# EAGLE design Digipot (EAGLE 9.3.0)
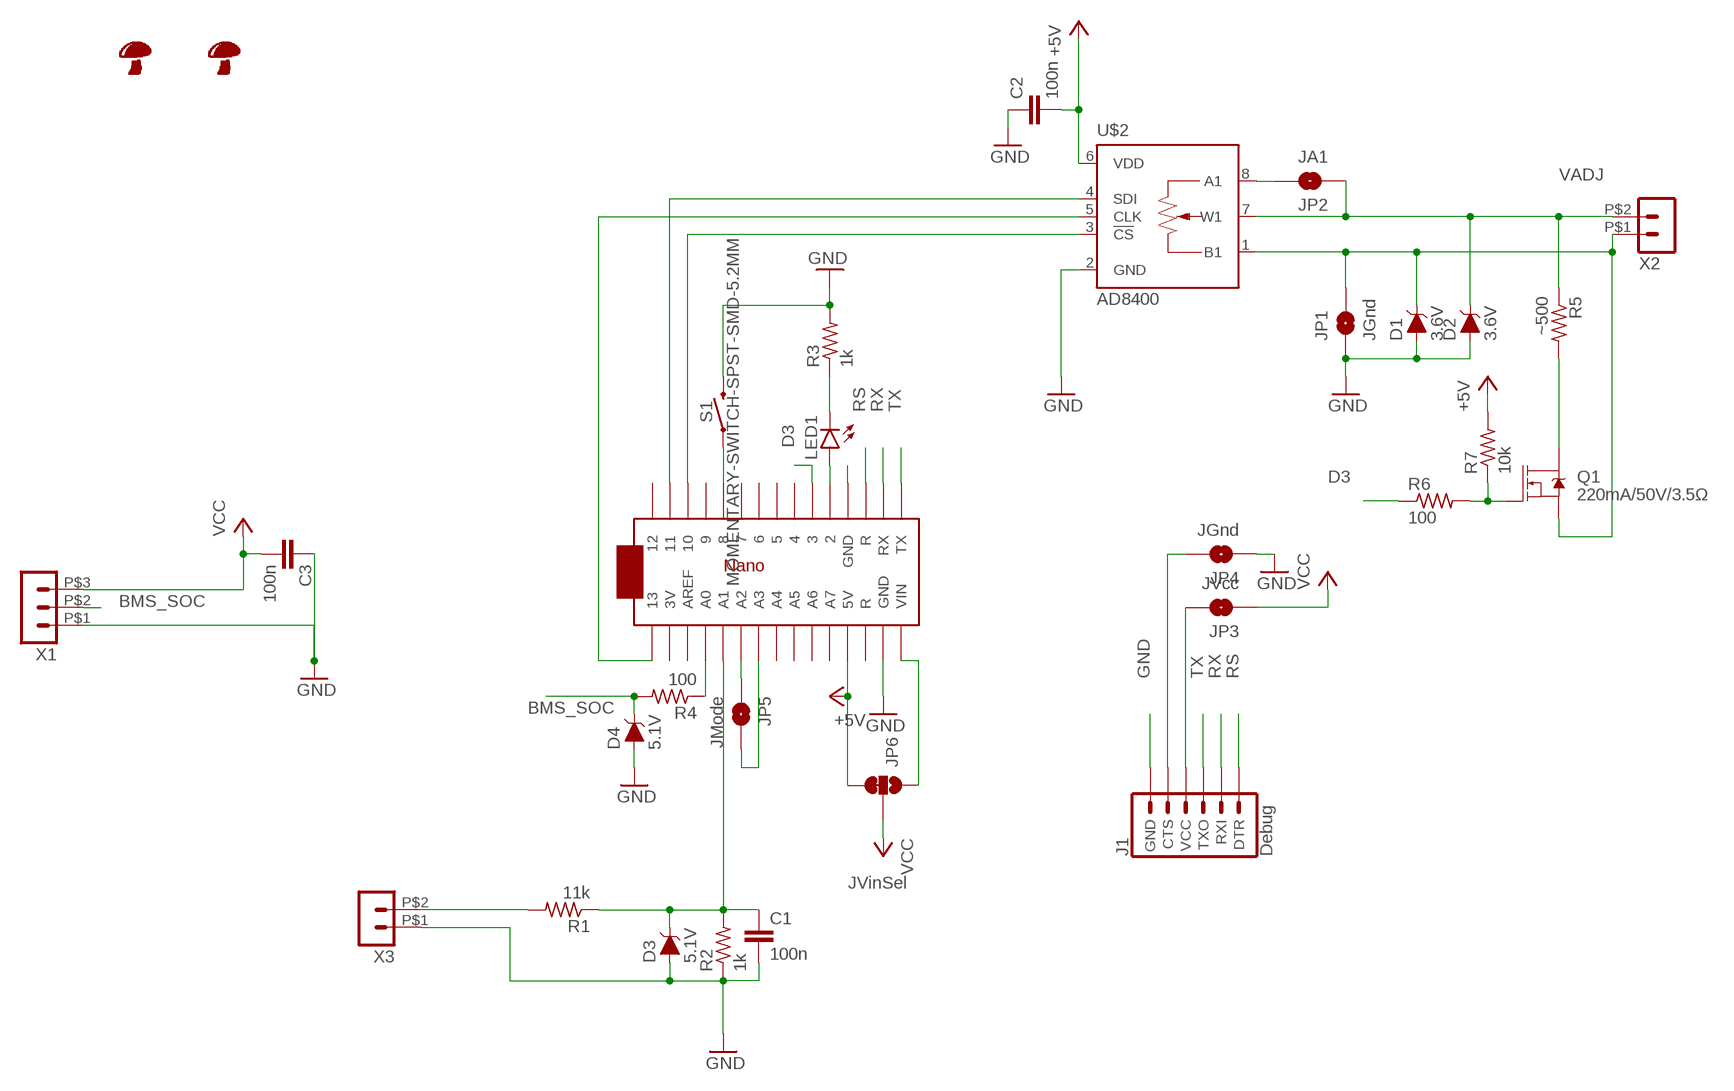
[diagram p0: schematic, sheet 1]

## Parts
C1  100n  C-EUC0805  [C0805]
C2  100n  C-EUC0805  [C0805]
C3  100n  C-EUC0805  [C0805]
D1  3.6V  DIODE-ZENER-BZT52C3V6S  [SOD-323]
D2  3.6V  DIODE-ZENER-BZT52C3V6S  [SOD-323]
D3  5.1V  DIODE-ZENER-BZT52C3V6S  [SOD-323]
D4  5.1V  DIODE-ZENER-BZT52C3V6S  [SOD-323]
J1  Debug  6_PIN_SERIAL_TARGETLOCK  [1X06_LOCK]
JP1  JGnd  JUMPER-SMT_2_NO_SILK  [SMT-JUMPER_2_NO_SILK]
JP2  JA1  JUMPER-SMT_2_NO_SILK  [SMT-JUMPER_2_NO_SILK]
JP3  JVcc  JUMPER-SMT_2_NO_SILK  [SMT-JUMPER_2_NO_SILK]
JP4  JGnd  JUMPER-SMT_2_NO_SILK  [SMT-JUMPER_2_NO_SILK]
JP5  JMode  JUMPER-SMT_2_NO_SILK  [SMT-JUMPER_2_NO_SILK]
JP6  JVinSel  JUMPER-SMT_3_1-NC_TRACE_SILK  [SMT-JUMPER_3_1-NC_TRACE_SILK]
LED1  LEDCHIPLED_0805  [CHIPLED_0805]
Q1  220mA/50V/3.5Ω  MOSFET-NCH-BSS138  [SOT23-3]
R1  11k  R-US_R0805  [R0805]
R2  1k  R-US_R0805  [R0805]
R3  1k  R-US_R0805  [R0805]
R4  100  R-US_R0805  [R0805]
R5  ~500  R-US_R0805  [R0805]
R6  100  R-US_R0805  [R0805]
R7  10k  R-US_R0805  [R0805]
S1  MOMENTARY-SWITCH-SPST-SMD-5.2MM  [TACTILE_SWITCH_SMD_5.2MM]
U$1  ARDUINO_NANOARDUINONANO  [ARDUINOMICRO]
U$2  AD8400  [SOIC08]
U$3  SHROOMTOPSILK  [SHROOM_TS]
U$4  SHROOM5MM  [SHROOM]
X1  HEADER_POS3_43650-0300  [43650-0300]
X2  HEADER_POS2_43650-0200  [43650-0200]
X3  HEADER_POS2_43650-0200  [43650-0200]

## Nets
+5V: C2.2 JP6.3 R7.2 U$1.P$23(5V) U$2.6(VDD)
BMS_SOC: D4.C R4.2 X1.P$2
D3: R6.1 U$1.P$10
GND: C1.2 C2.1 C3.1 D1.A D2.A D3.A D4.A J1.6(GND) JP1.1 JP4.1 R2.1 R3.2 S1.3 U$1.P$12(GND) U$1.P$21(GND) U$2.2(GND) X1.P$1 X3.P$1
N$1: C1.1 D3.C R1.1 R2.2 U$1.P$30(A1)
N$2: R1.2 X3.P$2
N$3: D1.C JP1.2 Q1.2(S) U$2.1(B1) X2.P$1
N$4: U$1.P$3 U$2.3(!CS)
N$5: U$1.P$2 U$2.4(SDI)
N$6: U$1.P$34 U$2.5(CLK)
N$7: J1.4(VCC) JP3.2
N$8: JP2.2 U$2.8(A1)
N$9: J1.5(CTS) JP4.2
N$10: LED1.C R3.1
N$11: LED1.A U$1.P$11
N$12: R4.1 U$1.P$31(A0)
N$13: JP5.1 U$1.P$29(A2)
N$14: JP5.2 U$1.P$28(A3)
N$15: JP6.1 U$1.P$20(VIN)
N$16: Q1.3(D) R5.2
N$17: Q1.1(G) R6.2 R7.1
N$18: S1.1 U$1.P$5
RS: J1.1(DTR) U$1.P$22(R)
RX: J1.2(RXI) U$1.P$14(RX)
TX: J1.3(TXO) U$1.P$15(TX)
VADJ: D2.C JP2.1 R5.1 U$2.7(W1) X2.P$2
VCC: C3.2 JP3.1 JP6.2 X1.P$3
Unconnected: U$1.P$1 U$1.P$4 U$1.P$6 U$1.P$7 U$1.P$8 U$1.P$9 U$1.P$13(R) U$1.P$24(A7) U$1.P$25(A6) U$1.P$26(A5) U$1.P$27(A4) U$1.P$32(AREF) U$1.P$33(3V)

## Library data of the parts
C1-C3 = resistor:C-EU: CAPACITOR, European symbol
D1 D2 = SparkFun-DiscreteSemi:DIODE-ZENER: Zener Diode A Zener diode allows current to flow from its anode to its cathode like a normal semiconductor diode, but it also permits current to flow in the reverse direction when its "Zener voltage" is reached. - WIkipedia; PROD_ID: DIO-08199
D3 D4 = SparkFun-DiscreteSemi:DIODE-ZENER: Zener Diode A Zener diode allows current to flow from its anode to its cathode like a normal semiconductor diode, but it also permits current to flow in the reverse direction when its "Zener voltage" is reached. - WIkipedia; PROD_ID: DIO-08199; VALUE: 3.6V
J1 = SparkFun-Connectors:6_PIN_SERIAL_TARGET: 6-pin header connection for use with the "FTDI BASIC" pinout - TARGET SIDE. Also known as "Arduino Serial Program Header". It is used to mate with our FTDI Basic serial programmers using the Arduino IDE. Note, this device has "TARGET" in the name. It is intended to be used on a design that contains a target micro-controller that you wish to program. The "sister" device, named "CABLE" is inteneded to be used on a design that usually lives on the end of your USB cable and prvides the converter chip (FTDI232 or FTDI231x) to commnicate serial RX/TX. You can populate with some of these: Break Away Headers - Straight <https://www.sparkfun.com/products/116> (PRT-00116) For reference (or to suit your programming needs) check out these designs: SparkFun FTDI Basic Breakout - 5V <https://www.sparkfun.com/products/9716> (DEV-09716) SparkFun FTDI Basic Breakout - 3.3V <https://www.sparkfun.com/products/9873> (DEV-09873) SparkFun FTDI SmartBasic <https://www.sparkfun.com/products/12935> (DEV-12935) SparkFun Beefy 3 - FTDI Basic Breakout <https://www.sparkfun.com/products/13746> (DEV-13746); PROD_ID: CONN-08437
JP1-JP5 = SparkFun-Jumpers:JUMPER-SMT_2_NO: Normally open jumper This jumper has two pads in close proximity to each other. Apply solder to close the connection. Round pads are easier to solder for beginners, but are a lot larger. SparkFun Product that uses the round pads: SparkFun EL Sequencer <https://www.sparkfun.com/products/12781>
JP6 = SparkFun-Jumpers:JUMPER-SMT_3_1-NC_TRACE: Normally closed trace jumper (1 of 2 connections) This jumper has a trace between two pads so it's normally closed (NC). The other connection is normally open (NO). Use a razor knife to open the connection. For best results follow the IPC guidelines for cutting traces: Cutout at least 0.063 mm (0.005 in). Remove all loose material to clean up the cut area. Seal the cut with an approved epoxy. Reapply solder to reclose the connection, or to close the NO connection.
LED1 = led:LED: LED OSRAM: - CHIPLED LG R971, LG N971, LY N971, LG Q971, LY Q971, LO R971, LY R971 LH N974, LH R974 LS Q976, LO Q976, LY Q976 LO Q996 - Hyper CHIPLED LW Q18S LB Q993, LB Q99A, LB R99A - SideLED LS A670, LO A670, LY A670, LG A670, LP A670 LB A673, LV A673, LT A673, LW A673 LH A674 LY A675 LS A676, LA A676, LO A676, LY A676, LW A676 LS A679, LY A679, LG A679 - Hyper Micro SIDELED® LS Y876, LA Y876, LO Y876, LY Y876 LT Y87S - SmartLED LW L88C, LW L88S LB L89C, LB L89S, LG L890 LS L89K, LO L89K, LY L89K LS L896, LA L896, LO L896, LY L896 - TOPLED LS T670, LO T670, LY T670, LG T670, LP T670 LSG T670, LSP T670, LSY T670, LOP T670, LYG T670 LG T671, LOG T671, LSG T671 LB T673, LV T673, LT T673, LW T673 LH T674 LS T676, LA T676, LO T676, LY T676, LB T676, LH T676, LSB T676, LW T676 LB T67C, LV T67C, LT T67C, LS T67K, LO T67K, LY T67K, LW E67C LS E67B, LA E67B, LO E67B, LY E67B, LB E67C, LV E67C, LT E67C LW T67C LS T679, LY T679, LG T679 LS T770, LO T770, LY T770, LG T770, LP T770 LB T773, LV T773, LT T773, LW T773 LH T774 LS E675, LA E675, LY E675, LS T675 LS T776, LA T776, LO T776, LY T776, LB T776 LHGB T686 LT T68C, LB T68C - Hyper Mini TOPLED® LB M676 - Mini TOPLED Santana® LG M470 LS M47K, LO M47K, LY M47K Source: http://www.osram.convergy.de LUXEON: - LUMILED® LXK2-PW12-R00, LXK2-PW12-S00, LXK2-PW14-U00, LXK2-PW14-V00 LXK2-PM12-R00, LXK2-PM12-S00, LXK2-PM14-U00 LXK2-PE12-Q00, LXK2-PE12-R00, LXK2-PE12-S00, LXK2-PE14-T00, LXK2-PE14-U00 LXK2-PB12-K00, LXK2-PB12-L00, LXK2-PB12-M00, LXK2-PB14-N00, LXK2-PB14-P00, LXK2-PB14-Q00 LXK2-PR12-L00, LXK2-PR12-M00, LXK2-PR14-Q00, LXK2-PR14-R00 LXK2-PD12-Q00, LXK2-PD12-R00, LXK2-PD12-S00 LXK2-PH12-R00, LXK2-PH12-S00 LXK2-PL12-P00, LXK2-PL12-Q00, LXK2-PL12-R00 Source: www.luxeon.com KINGBRIGHT: KA-3528ASYC Source: www.kingbright.com
Q1 = SparkFun-DiscreteSemi:MOSFET-NCH: N-channel MOSFETs Voltage controlled devices that allow control of high current outputs. SparkFun Products: SparkFun OpenScale <https://www.sparkfun.com/products/13261> SparkFun Digital Sandbox <https://www.sparkfun.com/products/12651> SparkFun Monster Moto Shield <https://www.sparkfun.com/products/10182> SparkFun MOSFET Power Controller <https://www.sparkfun.com/products/11214>; PROD_ID: TRANS-00830
R1-R7 = resistor:R-US_: RESISTOR, American symbol
S1 = SparkFun-Switches:MOMENTARY-SWITCH-SPST: Momentary Switch (Pushbutton) - SPST Normally-open (NO) SPST momentary switches (buttons, pushbuttons). Variants PTH-12MM - 12mm square, through-hole Momentary Pushbutton Switch - 12mm Square <https://www.sparkfun.com/products/9190> (COM-09190) PTH-6.0MM, PTH-6.0MM-KIT - 6.0mm square, through-hole Mini Pushbutton Switch <https://www.sparkfun.com/products/97> (COM-00097) KIT package intended for soldering kit's - only one side of pads' copper is exposed. PTH-RIGHT-ANGLE-KIT - Right-angle, through-hole Right Angle Tactile Button <https://www.sparkfun.com/products/10791> - Used on SparkFun BigTime Watch Kit <https://www.sparkfun.com/products/11734> SMD-12MM - 12mm square, surface-mount Tactile Button - SMD (12mm) <https://www.sparkfun.com/products/12993> (COM-12993) Used on SparkFun PicoBoard <https://www.sparkfun.com/products/11888> SMD-4.5MM - 4.5mm Square Trackball Switch Used on SparkFun Blackberry Trackballer Breakout <https://www.sparkfun.com/products/13169> SMD-4.6MMX2.8MM - 4.60mm x 2.80mm, surface mount Used on SparkFun SAMD21 Mini Breakout <https://www.sparkfun.com/products/13664> SMD-5.2MM, SMD-5.2-REDUNDANT - 5.2mm square, surface-mount Mini Pushbutton Switch - SMD <https://www.sparkfun.com/products/8720> (COM-08720) Used on Arduino Pro Mini <https://www.sparkfun.com/products/11114> REDUNDANT package connects both switch circuits together SMD-6.0X3.5MM - 6.0 x 3.5mm, surface mount Momentary Reset Switch SMD <https://www.sparkfun.com/products/8229> (COM-08229) SMD-6.2MM-TALL - 6.2mm square, surface mount Tactile Button - SMD (6mm) <https://www.sparkfun.com/products/12992> Used on SparkFun Digital Sandbox <https://www.sparkfun.com/products/12651> SMD-RIGHT-ANGLE - Right-angle, surface mount Used on SparkFun Block for Intel® Edison - Arduino <https://www.sparkfun.com/products/13036>; PROD_ID: SWCH-08247; SF_SKU: COM-08720
U$1 = RobThePyro:ARDUINO_NANO
U$2 = RobThePyro:AD8400
U$3 U$4 = RobThePyro:SHROOM
X1 = con-molex-micro-fit-3_0:HEADER_POS3_?: Molex - Micro-Fit 3.0 Series connector, 3.00mm (0.118") pitch header, 3 positions.
X2 X3 = con-molex-micro-fit-3_0:HEADER_POS2_?: Molex - Micro-Fit 3.0 Series connector, 3.00mm (0.118") pitch header, 2 positions.

## Board
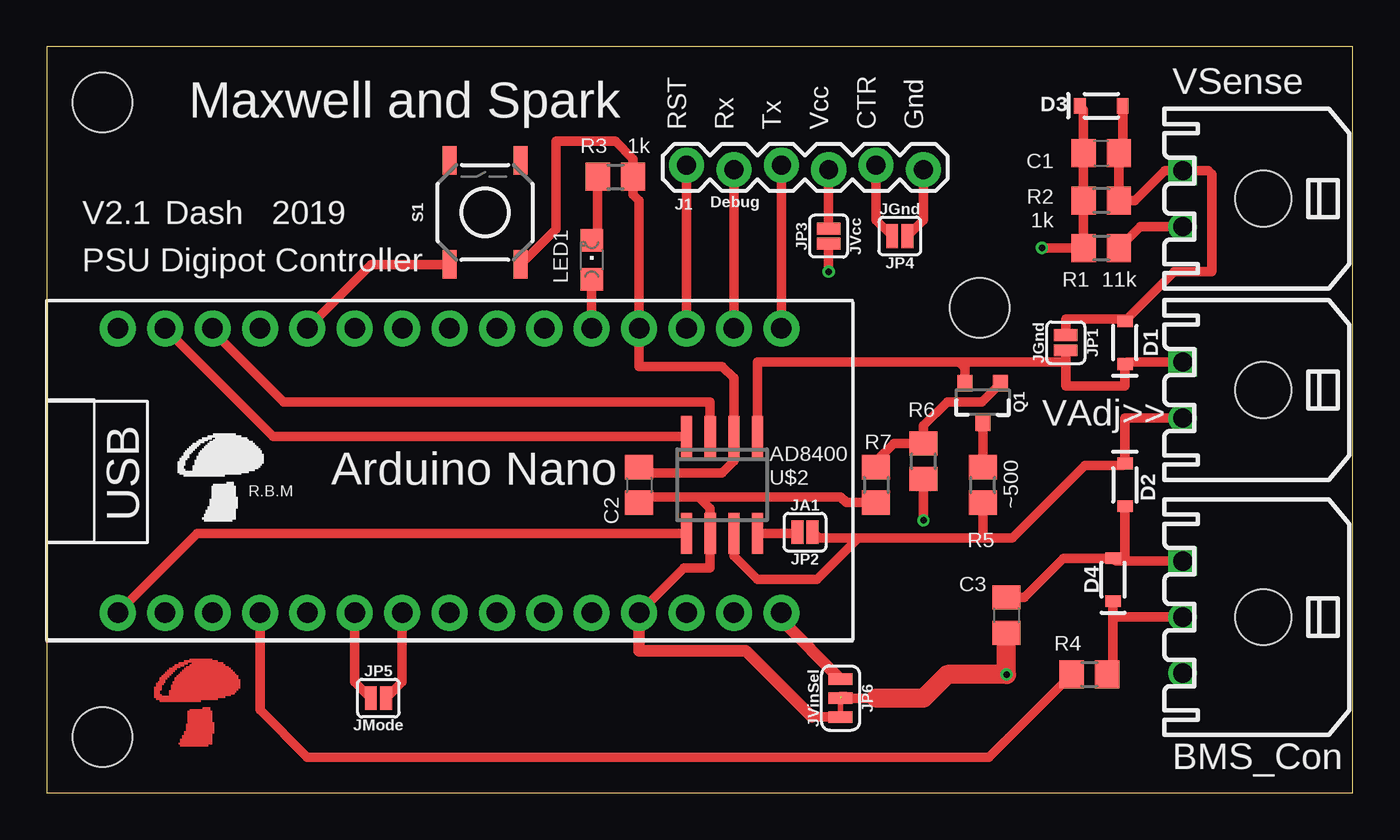
[diagram p1: board, top side]
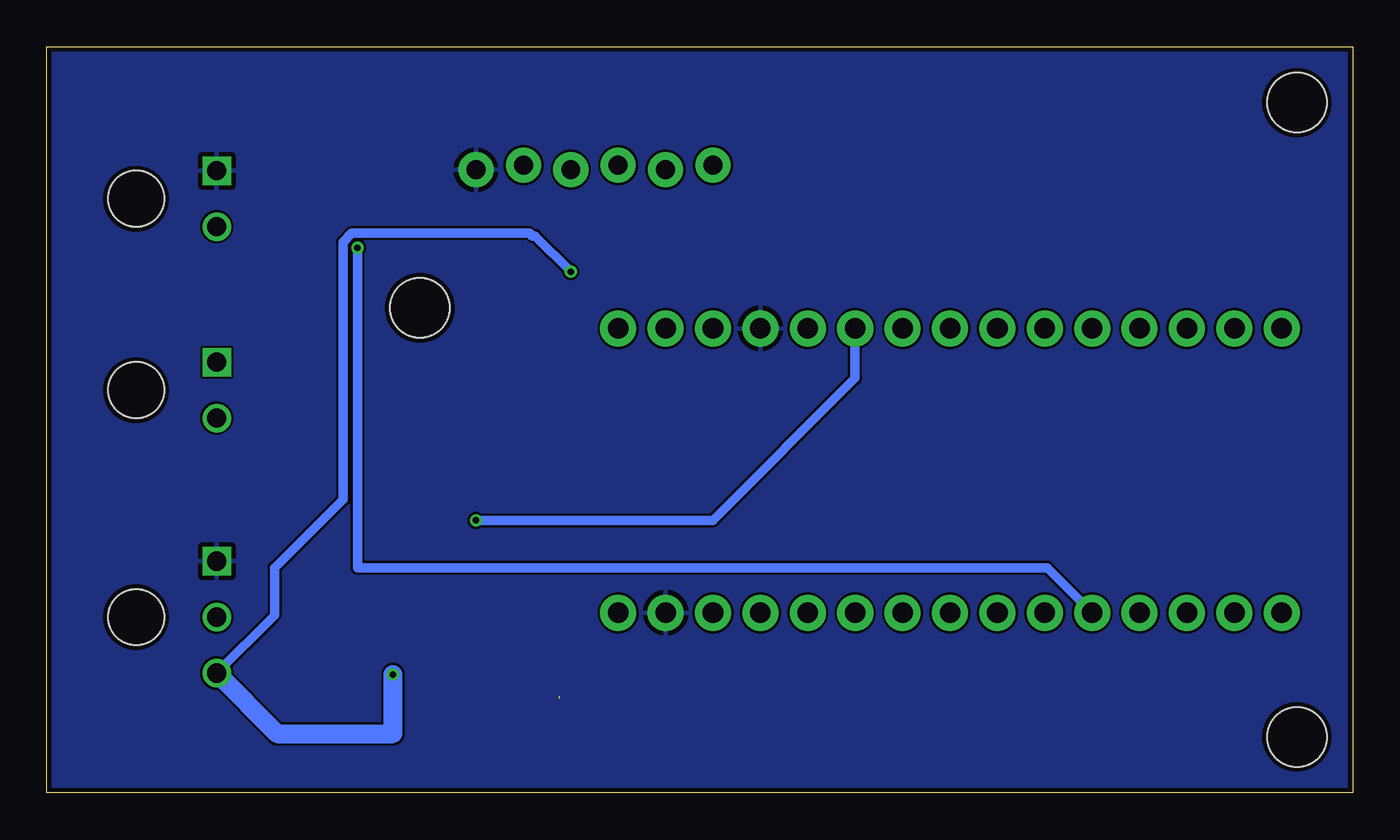
[diagram p2: board, bottom side, seen from below]

Size 70 x 40 mm. Coordinates in mm from the lower left corner, seen from the top.
Outline: 0,0 70,0 70,40 0,40 0,0
Copper layers (1*16): Top 0.035mm / dielectric 1.5mm / Bottom 0.035mm
Design rules "dirt_cheap_dirty_boards.v1": minimum track width 5mil, minimum drill 12mil, track to track 5mil, track to pad 5mil, pad to pad 5mil, via to via 5mil, smd to smd 0mil, copper to edge 10mil, drill to drill 10mil, minimum pad ring 10mil, minimum via ring 6mil, stop-mask expansion 2mil, vias tented up to drill 25mil, thermal gap 10mil
Holes 3.2 mm at 3,3 3,37 50,26

### Footprints (pad centres in the part's own frame; a part is rotated, then mirrored left to right if it is on the bottom)
C0805 = smd 1.3 x 1.5: 1 -0.95,0; 2 0.95,0
SOD-323 = smd 0.63 x 0.83: A 1.15,0; C -1.15,0
1X06_LOCK = drill 1.016 pad 1.88: 1 0,0; 2 2.54,-0.254; 3 5.08,0; 4 7.62,-0.254; 5 10.16,0; 6 12.7,-0.254
SMT-JUMPER_2_NO_SILK = smd 0.635 x 1.27: 1 -0.406,0; 2 0.406,0
SMT-JUMPER_3_1-NC_TRACE_SILK = smd 0.635 x 1.27: 1 -1.016,0; 2 0,0; 3 1.016,0
CHIPLED_0805 = smd 1.2 x 1.2: A 0,-1.05; C 0,1.05
SOT23-3 = smd 0.8 x 0.9: 1 -0.95,-1; 2 0.95,-1; 3 0,1.1
R0805 = smd 1.3 x 1.5: 1 -0.95,0; 2 0.95,0
TACTILE_SWITCH_SMD_5.2MM = smd 1.524 x 0.762: 1 -2.794,1.905; 2 2.794,1.905; 3 -2.794,-1.905; 4 2.794,-1.905
ARDUINOMICRO = drill 1.1 pad 1.93: P$1 -20.32,7.62; P$2 -17.78,7.62; P$3 -15.24,7.62; P$4 -12.7,7.62; P$5 -10.16,7.62; P$6 -7.62,7.62; P$7 -5.08,7.62; P$8 -2.54,7.62; P$9 0,7.62; P$10 2.54,7.62; P$11 5.08,7.62; P$12 12.7,-7.62; P$13 10.16,-7.62; P$14 12.7,7.62; P$15 15.24,7.62; P$20 15.24,-7.62; P$21 7.62,7.62; P$22 10.16,7.62; P$23 7.62,-7.62; P$24 5.08,-7.62; P$25 2.54,-7.62; P$26 0,-7.62; P$27 -2.54,-7.62; P$28 -5.08,-7.62; P$29 -7.62,-7.62; P$30 -10.16,-7.62; P$31 -12.7,-7.62; P$32 -15.24,-7.62; P$33 -17.78,-7.62; P$34 -20.32,-7.62
SOIC08 = smd 0.6 x 2.2: 1 -1.905,-2.6; 2 -0.635,-2.6; 3 0.635,-2.6; 4 1.905,-2.6; 5 1.905,2.6; 6 0.635,2.6; 7 -0.635,2.6; 8 -1.905,2.6
43650-0300 = drill 1.02 square: P$1 3,4.32 | drill 1.02: P$2 0,4.32; P$3 -3,4.32 | hole 3: 0,0
43650-0200 = drill 1.02 square: P$1 1.5,4.32 | drill 1.02: P$2 -1.5,4.32 | hole 3: 0,0

### Placement (x,y rotation side)
C1  56.52,34.29 0 top
C2  31.75,16.51 270 top
C3  51.44,9.53 270 top
D1  57.78,24.13 90 top
D2  57.78,16.51 270 top
D3  56.52,36.83 0 top
D4  57.15,11.43 90 top
J1  34.29,33.66 0 top
JP1  54.61,24.13 270 top
JP2  40.64,13.97 180 top
JP3  41.91,29.84 90 top
JP4  45.72,29.84 180 top
JP5  17.78,5.08 0 top
JP6  42.55,5.08 270 top
LED1  29.21,28.57 0 top
Q1  50.16,20.95 180 top
R1  56.52,29.21 0 top
R2  56.52,31.75 180 top
R3  30.48,33.02 0 top
R4  55.88,6.35 0 top
R5  50.16,16.51 90 top
R6  46.99,17.78 90 top
R7  44.45,16.51 270 top
S1  23.5,31.11 90 top
U$1  24.13,17.27 0 top
U$2  36.2,16.51 180 top
U$3  6.99,14.61 0 top
U$4  5.71,2.54 0 top
X1  65.2,9.42 90 top
X2  65.2,21.59 90 top
X3  65.2,31.85 90 top

### Tracks (layer width: path | path; a pad name or v marks a point on that pad's centre or on a via)
+5V
  Top 0.508: U$1.P$23 34.16,12.06 35.56,12.06 U$2.6 35.56,15.24 34.92,15.88 | C2.2 32.06,15.88 34.92,15.88 | R7.2 42.86,15.56 42.55,15.88 34.92,15.88 | JP6.3 41.02,4.06
  Top 0.61: U$1.P$23 31.75,7.62 37.47,7.62 41.02,4.06
BMS_SOC
  Top 0.508: X1.P$2 57.15,9.42 D4.C 57.15,6.67 R4.2
D3  (via drill 0.35)
  Top 0.508: R6.1 v46.99,14.61
  Bottom 0.508: v46.99,14.61 34.29,14.61 26.67,22.23 U$1.P$10
GND
  Top 0.508: C2.1 31.75,17.14 36.2,17.14 36.83,17.78 U$2.2 36.83,22.23 36.2,22.86 31.75,22.86 U$1.P$21 31.75,31.75 31.43,32.07 R3.2 31.43,33.98 30.48,34.92 27.3,34.92 27.3,30.23 S1.3 | D3.A 57.66,34.49 C1.2 R2.1 58.31,31.75 59.91,33.35 X3.P$1 62.26,33.35 62.44,33.17 62.44,27.94 60.45,27.94 57.84,25.34 | D2.A 57.78,12.42 X1.P$1 57.31,12.42 D4.A 54.49,12.58 52.38,10.47 C3.1 | D1.A 57.84,25.34 | JP1.1 54.61,25.4 57.78,25.4 57.84,25.34 | JP4.1 46.99,30.71 J1.6
  pour Bottom: 0,0 0,40 70,40 70,0
N$1  (via drill 0.35)
  Top 0.508: D3.C 55.56,36.63 C1.1 R2.2 R1.1 v53.34,29.21
  Bottom 0.508: U$1.P$30 16.38,12.06 53.34,12.06 v53.34,29.21
N$2
  Top 0.508: X3.P$2 58.6,30.35 R1.2
N$3
  Top 0.508: X2.P$1 57.9,23.09 D1.C 57.78,21.82 54.61,21.82 54.61,23.09 | 54.61,23.09 48.9,23.09 | 48.9,23.09 38.1,23.09 U$2.1 | JP1.2 54.61,23.09 | Q1.2 49.22,22.77 48.9,23.09
N$4
  Top 0.508: U$2.3 35.56,20.95 12.7,20.95 8.89,24.77 U$1.P$3
N$5
  Top 0.508: U$2.4 12.13,19.11 U$1.P$2
N$6
  Top 0.508: U$2.5 8.07,13.91 U$1.P$34
N$7
  Top 0.508: J1.4 JP3.2
N$8
  Top 0.508: U$2.8 40.17,13.91 JP2.2
N$9
  Top 0.508: JP4.2 44.45,30.71 J1.5
N$10
  Top 0.508: LED1.C 29.53,29.95 R3.1
N$11
  Top 0.508: U$1.P$11 LED1.A
N$12
  Top 0.508: R4.1 50.48,1.91 13.97,1.91 11.43,4.45 U$1.P$31
N$13
  Top 0.508: JP5.1 16.51,5.94 U$1.P$29
N$14
  Top 0.508: JP5.2 19.05,5.94 U$1.P$28
N$15
  Top 0.508: 39.37,9.27 U$1.P$20
  Top 0.61: JP6.1 39.37,9.27
N$16
  Top 0.508: R5.2 Q1.3
N$17
  Top 0.508: Q1.1 50.12,20.95 48.26,20.95 46.99,19.68 R6.2 45.4,18.73 44.45,17.78 R7.1
N$18
  Top 0.508: U$1.P$5 17.4,28.32 S1.1
RS
  Top 0.508: J1.1 U$1.P$22
RX
  Top 0.508: U$1.P$14 J1.2
TX
  Top 0.508: U$1.P$15 J1.3
VADJ
  Top 0.508: U$2.7 36.83,12.7 38.1,11.43 41.27,11.43 43.5,13.65 | X2.P$2 57.78,20.09 D2.C 57.67,17.55 55.65,17.55 51.75,13.65 50.16,13.65 | JP2.1 41.36,13.65 43.5,13.65 | 43.5,13.65 50.16,13.65 | R5.1 50.16,13.65
VCC  (via drill 0.35, 0.35 pad 0.6)  (1 unrouted)
  Top 0.508: JP3.1 v41.91,27.94 | 44.45,5.08 42.94,5.08 42.84,5.18 42.55,5.18
  Top 1.016: C3.2 v51.44,6.35 48.26,6.35 46.99,5.08 44.45,5.08
  Bottom 0.508: v41.91,27.94 43.81,29.84 43.98,29.84 44.12,30 53.66,30 54.12,29.54 54.12,15.72 57.78,12.06 57.78,9.52 X1.P$3
  Bottom 1.016: X1.P$3 57.64,3.17 51.44,3.17 v51.44,6.35

### Text on the board
tNames: VSense | Maxwell and Spark | RST | Rx | Tx | Vcc | CTR | Gnd | V2.1 | Dash | 2019 | PSU Digipot Controller | USB | VAdj>> | Arduino Nano | R.B.M | BMS_Con